# EAGLE schematic LR21_Dash (EAGLE 9.2.2)
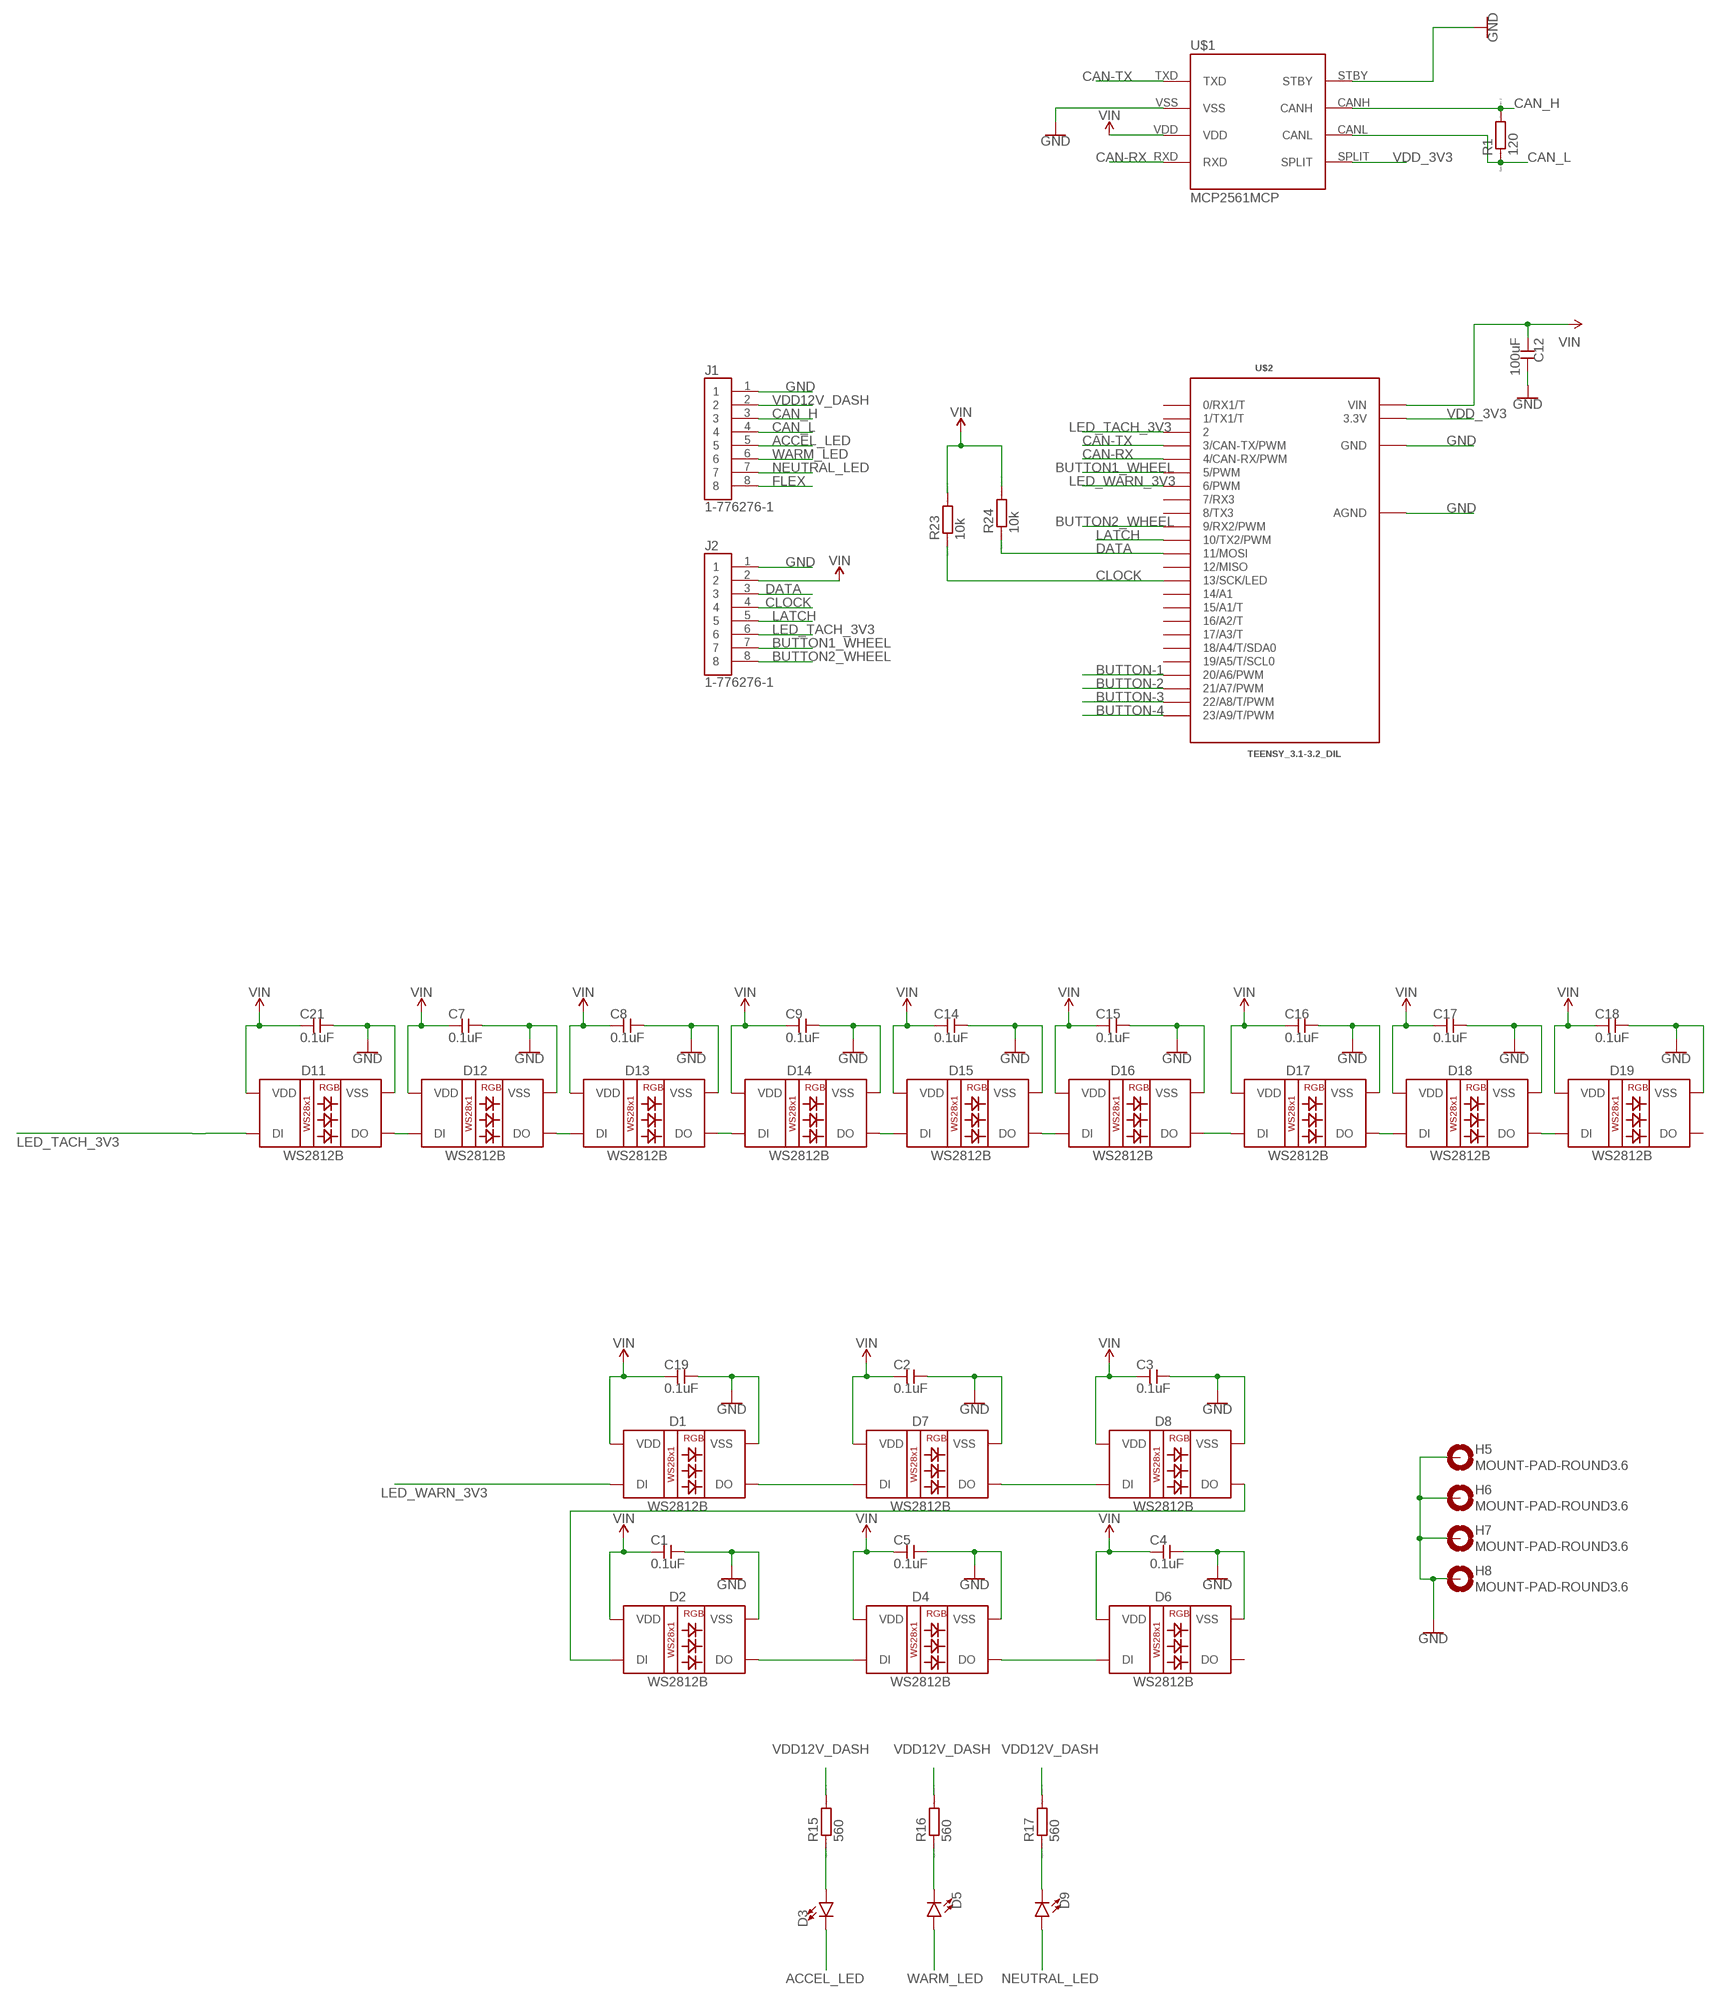
[diagram p0: schematic, sheet 1, part 1 of 2]
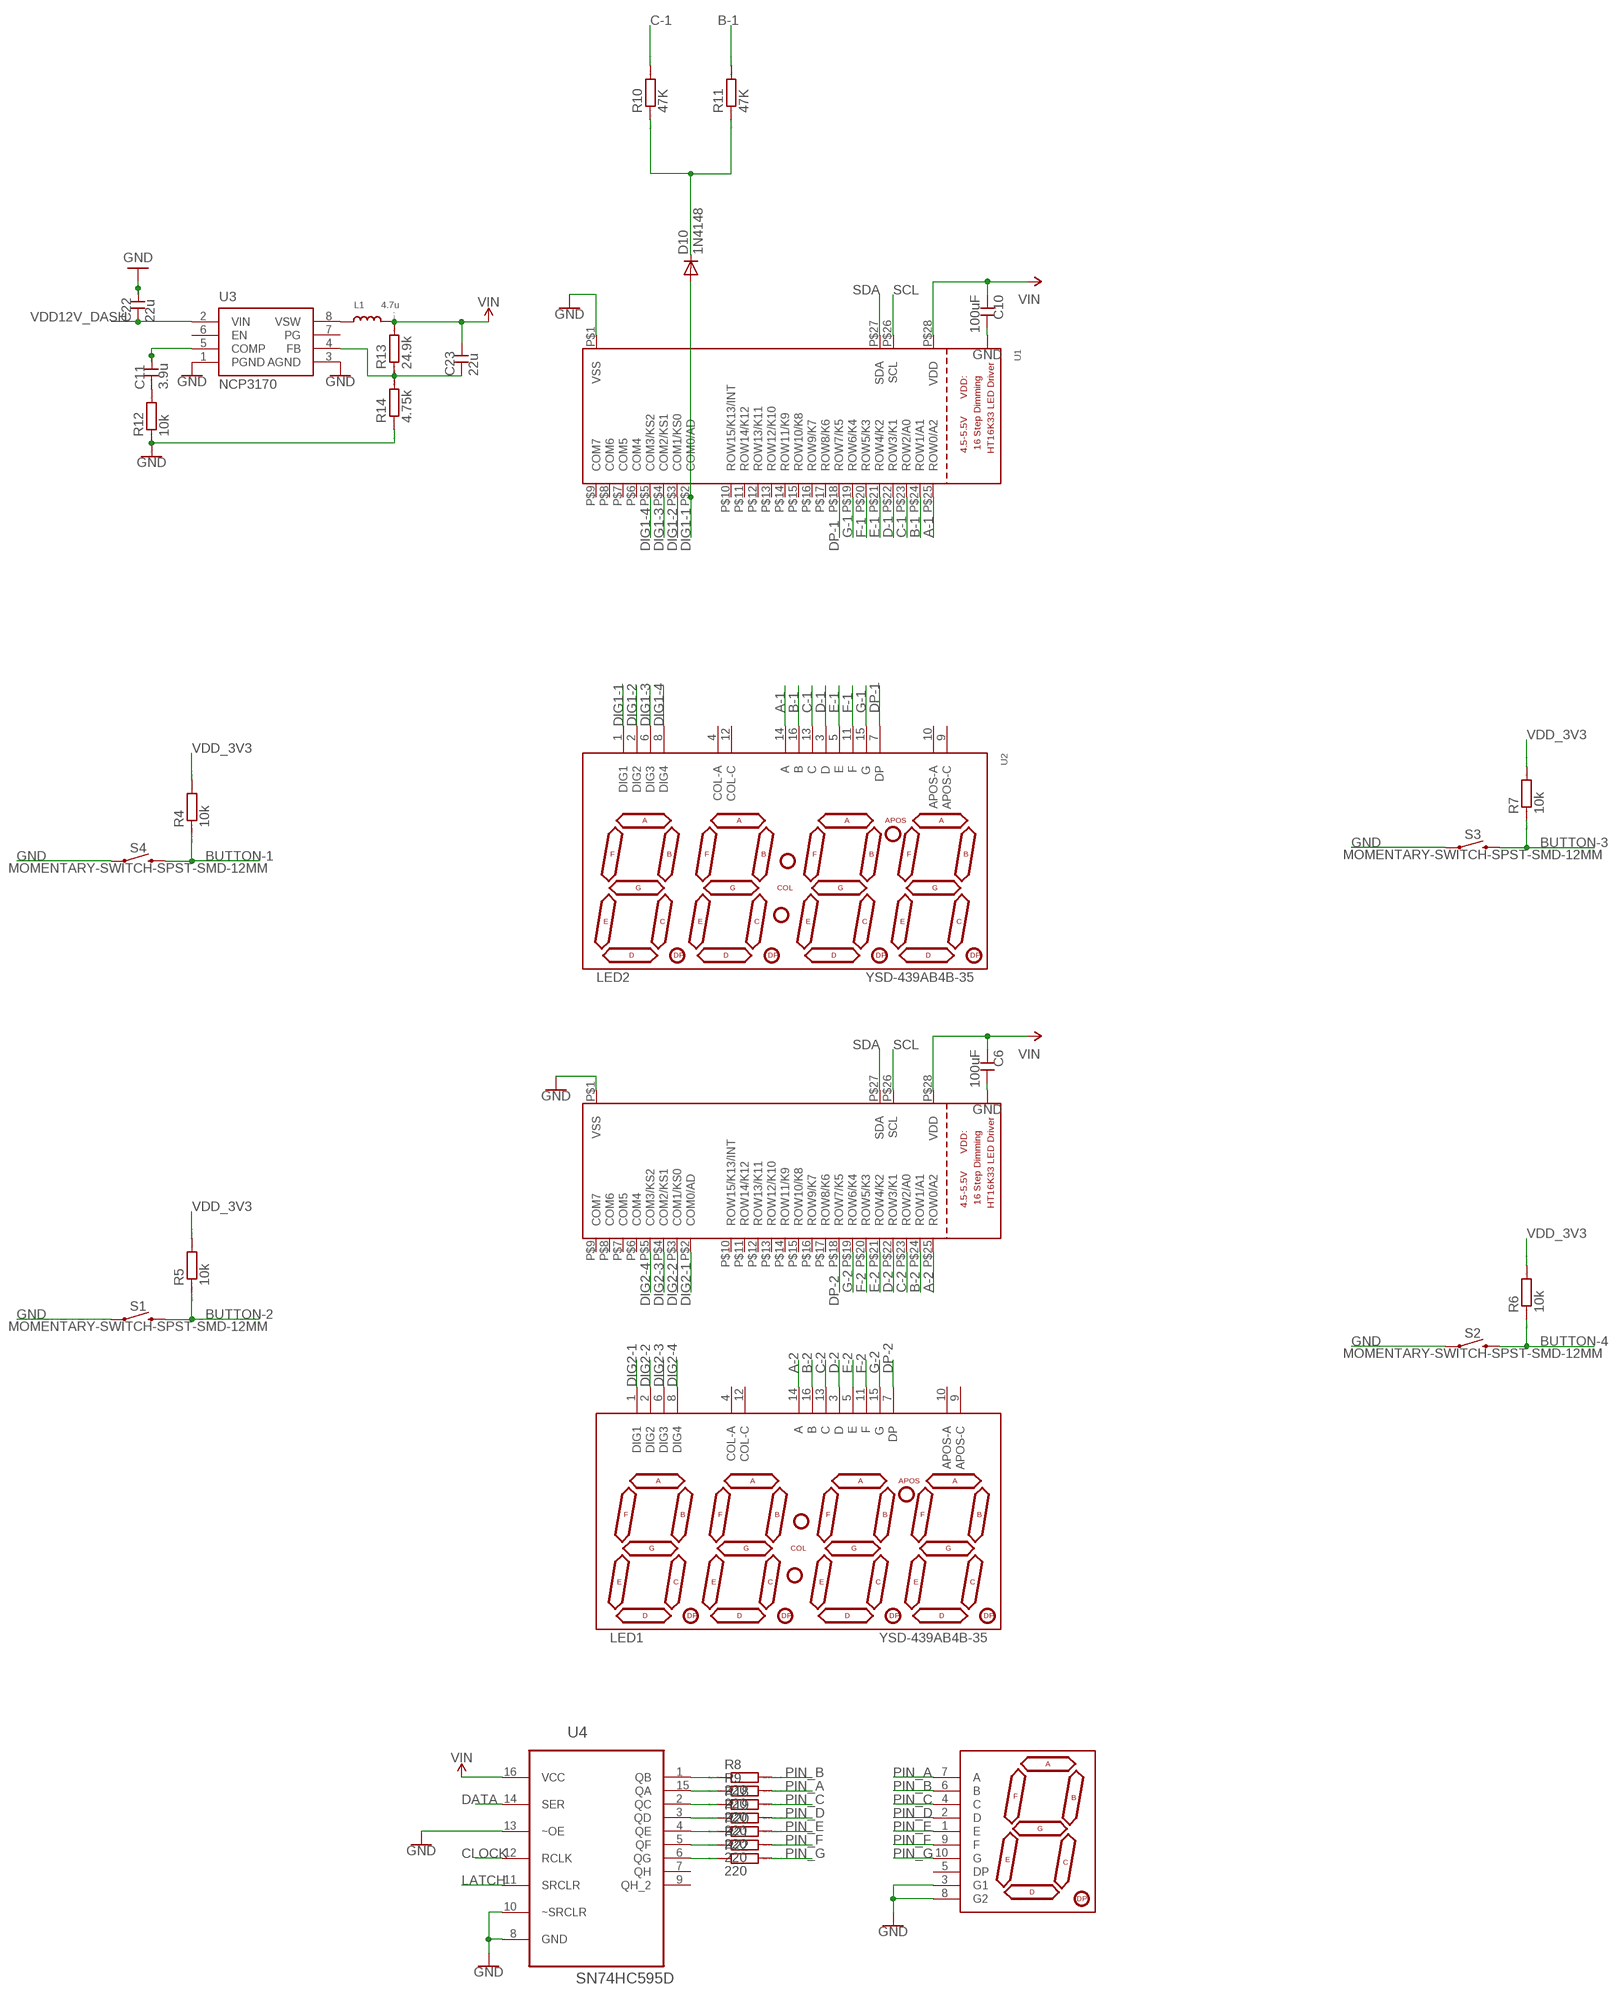
[diagram p1: schematic, sheet 1, part 2 of 2]

## Parts
C1  0.1uF  CAP-1005  [1005]
C2  0.1uF  CAP-1005  [1005]
C3  0.1uF  CAP-1005  [1005]
C4  0.1uF  CAP-1005  [1005]
C5  0.1uF  CAP-1005  [1005]
C6  100uF  CAP-1005  [1005]
C7  0.1uF  CAP-1005  [1005]
C8  0.1uF  CAP-1005  [1005]
C9  0.1uF  CAP-1005  [1005]
C10  100uF  CAP-1005  [1005]
C11  3.9u  CAP-1005  [1005]
C12  100uF  CAP-1005  [1005]
C14  0.1uF  CAP-1005  [1005]
C15  0.1uF  CAP-1005  [1005]
C16  0.1uF  CAP-1005  [1005]
C17  0.1uF  CAP-1005  [1005]
C18  0.1uF  CAP-1005  [1005]
C19  0.1uF  CAP-1005  [1005]
C21  0.1uF  CAP-1005  [1005]
C22  22u  CAP-1005  [1005]
C23  22u  CAP-1005  [1005]
D1  WS2812B  [WS2812B]
D2  WS2812B  [WS2812B]
D3  LED5MM  [LED_5MM]
D4  WS2812B  [WS2812B]
D5  LED5MM  [LED_5MM]
D6  WS2812B  [WS2812B]
D7  WS2812B  [WS2812B]
D8  WS2812B  [WS2812B]
D9  LED5MM  [LED_5MM]
D10  1N4148  [DO35-10]
D11  WS2812B  [WS2812B]
D12  WS2812B  [WS2812B]
D13  WS2812B  [WS2812B]
D14  WS2812B  [WS2812B]
D15  WS2812B  [WS2812B]
D16  WS2812B  [WS2812B]
D17  WS2812B  [WS2812B]
D18  WS2812B  [WS2812B]
D19  WS2812B  [WS2812B]
H5  MOUNT-PAD-ROUND3.6  [3,6-PAD]
H6  MOUNT-PAD-ROUND3.6  [3,6-PAD]
H7  MOUNT-PAD-ROUND3.6  [3,6-PAD]
H8  MOUNT-PAD-ROUND3.6  [3,6-PAD]
J1  1-776276-1  [TE_1-776276-1]
J2  1-776276-1  [TE_1-776276-1]
L1  4.7u  INDUCTOR  [INDUCTOR_1007]
LED1  YSD-439AB4B-35  7-SEGMENT-4DIGIT-10MM-BLUE  [7-SEGMENT-4DIGIT-YOUNGSUN]
LED2  YSD-439AB4B-35  7-SEGMENT-4DIGIT-10MM-BLUE  [7-SEGMENT-4DIGIT-YOUNGSUN]
R1  120  R  [R0805]
R4  10k  R  [R0805]
R5  10k  R  [R0805]
R6  10k  R  [R0805]
R7  10k  R  [R0805]
R8  220  R  [R0805]
R9  220  R  [R0805]
R10  47K  R  [R0805]
R11  47K  R  [R0805]
R12  10k  R  [R0805]
R13  24.9k  R  [R0805]
R14  4.75k  R  [R0805]
R15  560  R  [R0805]
R16  560  R  [R0805]
R17  560  R  [R0805]
R18  220  R  [R0805]
R19  220  R  [R0805]
R20  220  R  [R0805]
R21  220  R  [R0805]
R22  220  R  [R0805]
R23  10k  R  [R0805]
R24  10k  R  [R0805]
S1  MOMENTARY-SWITCH-SPST-SMD-12MM  [TACTILE_SWITCH_SMD_12MM]
S2  MOMENTARY-SWITCH-SPST-SMD-12MM  [TACTILE_SWITCH_SMD_12MM]
S3  MOMENTARY-SWITCH-SPST-SMD-12MM  [TACTILE_SWITCH_SMD_12MM]
S4  MOMENTARY-SWITCH-SPST-SMD-12MM  [TACTILE_SWITCH_SMD_12MM]
U1  HT16K33_SOP28  [SOP28_300MIL]
U2  HT16K33_SOP28  [SOP28_300MIL]
U3  NCP3170  [SOIC8]
U4  SN74HC595D  [SOIC127P600X175-16N]
U$1  MCP2561MCP  [MCP2561_PDIP]
U$2  TEENSY_3.1-3.2_DIL  [TEENSY_3.0-3.2&LC_DIL]
U$3  YSD-160AB3C-8  7-SEGMENT-1DIGIT-1INCH-BLUE  [7-SEGMENT-1"PTH]

## Nets
A-1: LED2.14(A) U1.P$25(ROW0/A2)
A-2: LED1.14(A) U2.P$25(ROW0/A2)
ACCEL_LED [pwr]: D3.K(C) J1.5
B-1: LED2.16(B) R11.2 U1.P$24(ROW1/A1)
B-2: LED1.16(B) U2.P$24(ROW1/A1)
BUTTON1_WHEEL: J2.7 U$2.5(5/PWM)
BUTTON2_WHEEL: J2.8 U$2.9(9/RX2/PWM)
BUTTON-1: R4.1 S4.3 U$2.20/A6(20/A6/PWM)
BUTTON-2: R5.1 S1.3 U$2.21/A7(21/A7/PWM)
BUTTON-3: R7.1 S3.3 U$2.22/A8(22/A8/T/PWM)
BUTTON-4: R6.1 S2.3 U$2.23/A9(23/A9/T/PWM)
C-1: LED2.13(C) R10.2 U1.P$23(ROW2/A0)
C-2: LED1.13(C) U2.P$23(ROW2/A0)
CAN-RX: U$1.RXD U$2.4(4/CAN-RX/PWM)
CAN-TX: U$1.TXD U$2.3(3/CAN-TX/PWM)
CAN_H: J1.3 R1.2 U$1.CANH
CAN_L: J1.4 R1.1 U$1.CANL
CLOCK: J2.4 R23.1 U4.12(RCLK) U$2.13(13/SCK/LED)
D-1: LED2.3(D) U1.P$22(ROW3/K1)
D-2: LED1.3(D) U2.P$22(ROW3/K1)
DATA: J2.3 R24.1 U4.14(SER) U$2.11(11/MOSI)
DIG1-1: D10.A LED2.1(DIG1) U1.P$2(COM0/AD)
DIG1-2: LED2.2(DIG2) U1.P$3(COM1/KS0)
DIG1-3: LED2.6(DIG3) U1.P$4(COM2/KS1)
DIG1-4: LED2.8(DIG4) U1.P$5(COM3/KS2)
DIG2-1: LED1.1(DIG1) U2.P$2(COM0/AD)
DIG2-2: LED1.2(DIG2) U2.P$3(COM1/KS0)
DIG2-3: LED1.6(DIG3) U2.P$4(COM2/KS1)
DIG2-4: LED1.8(DIG4) U2.P$5(COM3/KS2)
DP-1: LED2.7(DP) U1.P$18(ROW7/K5)
DP-2: LED1.7(DP) U2.P$18(ROW7/K5)
E-1: LED2.5(E) U1.P$21(ROW4/K2)
E-2: LED1.5(E) U2.P$21(ROW4/K2)
F-1: LED2.11(F) U1.P$20(ROW5/K3)
F-2: LED1.11(F) U2.P$20(ROW5/K3)
FLEX: J1.8
G-1: LED2.15(G) U1.P$19(ROW6/K4)
G-2: LED1.15(G) U2.P$19(ROW6/K4)
GND [pwr]: C1.P$2 C2.P$2 C3.P$2 C4.P$2 C5.P$2 C6.P$2 C7.P$2 C8.P$2 C9.P$2 C10.P$2 C12.P$2 C14.P$2 C15.P$2 C16.P$2 C17.P$2 C18.P$2 C19.P$2 C21.P$2 C22.P$2 D1.3(VSS) D2.3(VSS) D4.3(VSS) D6.3(VSS) D7.3(VSS) D8.3(VSS) D11.3(VSS) D12.3(VSS) D13.3(VSS) D14.3(VSS) D15.3(VSS) D16.3(VSS) D17.3(VSS) D18.3(VSS) D19.3(VSS) H5.B3,6(MOUNT) H6.B3,6(MOUNT) H7.B3,6(MOUNT) H8.B3,6(MOUNT) J1.1 J2.1 R12.1 R14.1 S1.1 S2.1 S3.1 S4.1 U1.P$1(VSS) U2.P$1(VSS) U3.1(PGND) U3.3(AGND) U4.8(GND) U4.10(~SRCLR) U4.13(~OE) U$1.STBY U$1.VSS U$2.AGND U$2.GND U$3.3(G1) U$3.8(G2)
LATCH: J2.5 U4.11(SRCLR) U$2.10(10/TX2/PWM)
LED_TACH_3V3: D11.4(DI) J2.6 U$2.2
LED_WARN_3V1: D13.2(DO) D14.4(DI)
LED_WARN_3V3: D1.4(DI) U$2.6(6/PWM)
N$2: D10.C R10.1 R11.1
N$4: D2.2(DO) D4.4(DI)
N$6: D4.2(DO) D6.4(DI)
N$8: D3.A R15.1
N$9: D5.K(C) R16.1
N$10 [pwr]: C11.P$2 U3.5(COMP)
N$11: D9.K(C) R17.1
N$12: C11.P$1 R12.2
N$14: D2.4(DI) D8.2(DO)
N$15: L1.P$1 U3.8(VSW)
N$16: R8.1 U4.1(QB)
N$17: R9.1 U4.15(QA)
N$18: R18.1 U4.2(QC)
N$19: R19.1 U4.3(QD)
N$20: R20.1 U4.4(QE)
N$21: D11.2(DO) D12.4(DI)
N$22 [pwr]: C23.P$1 R13.1 R14.2 U3.4(FB)
N$23: D1.2(DO) D7.4(DI)
N$24: D7.2(DO) D8.4(DI)
N$25: R21.1 U4.5(QF)
N$26: R22.1 U4.6(QG)
N$28: D12.2(DO) D13.4(DI)
N$29: D14.2(DO) D15.4(DI)
N$30: D15.2(DO) D16.4(DI)
N$31: D17.2(DO) D18.4(DI)
N$32: D18.2(DO) D19.4(DI)
N$33: D16.2(DO) D17.4(DI)
NEUTRAL_LED [pwr]: D9.A J1.7
PIN_A: R9.2 U$3.7(A)
PIN_B: R8.2 U$3.6(B)
PIN_C: R18.2 U$3.4(C)
PIN_D: R19.2 U$3.2(D)
PIN_E: R20.2 U$3.1(E)
PIN_F: R21.2 U$3.9(F)
PIN_G: R22.2 U$3.10(G)
SCL: U1.P$26(SCL) U2.P$26(SCL)
SDA: U1.P$27(SDA) U2.P$27(SDA)
VDD12V_DASH [pwr]: C22.P$1 J1.2 R15.2 R16.2 R17.2 U3.2(VIN)
VDD_3V3 [pwr]: R4.2 R5.2 R6.2 R7.2 U$1.SPLIT U$2.3.3V
VIN [pwr]: C1.P$1 C2.P$1 C3.P$1 C4.P$1 C5.P$1 C6.P$1 C7.P$1 C8.P$1 C9.P$1 C10.P$1 C12.P$1 C14.P$1 C15.P$1 C16.P$1 C17.P$1 C18.P$1 C19.P$1 C21.P$1 C23.P$2 D1.1(VDD) D2.1(VDD) D4.1(VDD) D6.1(VDD) D7.1(VDD) D8.1(VDD) D11.1(VDD) D12.1(VDD) D13.1(VDD) D14.1(VDD) D15.1(VDD) D16.1(VDD) D17.1(VDD) D18.1(VDD) D19.1(VDD) J2.2 L1.P$2 R13.2 R23.2 R24.2 U1.P$28(VDD) U2.P$28(VDD) U4.16(VCC) U$1.VDD U$2.VIN
WARM_LED [pwr]: D5.A J1.6
Unconnected: D6.2(DO) D19.2(DO) LED1.4(COL-A) LED1.9(APOS-C) LED1.10(APOS-A) LED1.12(COL-C) LED2.4(COL-A) LED2.9(APOS-C) LED2.10(APOS-A) LED2.12(COL-C) U1.P$6(COM4) U1.P$7(COM5) U1.P$8(COM6) U1.P$9(COM7) U1.P$10(ROW15/K13/INT) U1.P$11(ROW14/K12) U1.P$12(ROW13/K11) U1.P$13(ROW12/K10) U1.P$14(ROW11/K9) U1.P$15(ROW10/K8) U1.P$16(ROW9/K7) U1.P$17(ROW8/K6) U2.P$6(COM4) U2.P$7(COM5) U2.P$8(COM6) U2.P$9(COM7) U2.P$10(ROW15/K13/INT) U2.P$11(ROW14/K12) U2.P$12(ROW13/K11) U2.P$13(ROW12/K10) U2.P$14(ROW11/K9) U2.P$15(ROW10/K8) U2.P$16(ROW9/K7) U2.P$17(ROW8/K6) U3.6(EN) U3.7(PG) U4.7(QH) U4.9(QH_2) U$2.0(0/RX1/T) U$2.1(1/TX1/T) U$2.7(7/RX3) U$2.8(8/TX3) U$2.12(12/MISO) U$2.14/A0(14/A1) U$2.15/A1(15/A1/T) U$2.16/A2(16/A2/T) U$2.17/A3(17/A3/T) U$2.18/A4(18/A4/T/SDA0) U$2.19/A5(19/A5/T/SCL0) U$3.5(DP)

## Library data of the parts
C1-C12 C14-C19 C21-C23 = scenix4:CAP-1005
D1 D2 D4 D6-D8 D11-D19 = SparkFun-LED@1:WS2812B: WS2812B SMD addressable RGB LED 5x5mm SMD LED with built-in controller IC. Color: Red/Green/Blue mC Rating: RGB: 390, 660, 180 mcd Forward Voltage: RGB: 2.0, 3.0, 3.0 V Packages:WS2812B SparkFun Products: Blynk Board - ESP8266 <https://www.sparkfun.com/products/13794>; PROD_ID: DIO-12503
D3 D5 D9 = SparkFun-LED:LED: LED (Generic) Standard schematic elements and footprints for 5mm, 3mm, 1206, and 0603 sized LEDs. Generic LEDs with no color specified.
D10 = diode:1N4148: DIODE high speed (Philips)
H5-H8 = holes:MOUNT-PAD-ROUND: MOUNTING PAD, round
J1 J2 = 1-776276-1:1-776276-1: CONN HEADER 8POS VERT GOLD BLK; MANUFACTURER: TE Connectivity; METADATA: Manufacturer recommendations; PARTREV: B9
L1 = microbuilder:INDUCTOR: Inductors 0603: 10nH Ceramic Inductor - microwire antenna/RF (Digikey: 712-1434-2-ND) 0805: 560nH Ceramic Inductor - RF (Digikey: 553-1047-1-ND) 270nH Ceramic Inductor - Q = 40@250MHz, +-5%, 1 Ohm DC Resistance (Digikey: 535-10506-2-ND) 1007 (2518 Metric) SMT: 10µH 10% 250mOhm 820mA 1007 Inductor (Digikey: 587-2189-1-ND) 22µH 10% 500mOhm 580mA 1007 Inductor (Digikey: 587-2190-1-ND) 47µH 10% 950mOhm 420mA 1007 Inductor (Digikey: 587-2191-1-ND) 47µH 5% 100mOhm 1A 1008 Inductor (Digikey: 732-1816-1-ND) 5.0x5.0mm (Taiyo Yuden NR5040 Series) 6.8µH 20% 2.3A 64mOhm Inductor (Digikey: 587-2374-2-ND) 5.0x5.0mm (TDK VLC5045 Series) 4.7µH 20% 3.3A 34mOhm Inductor (Digikey: 445-6526-1-ND) 6.8µH 20% 2.7A 46mOhm Inductor (Digikey: 445-6527-1-ND) 6.0x6.0mm (TDK VLC6045 Series) 4.7µH 20% 3.8A 27mOhm Inductor (Digikey: 445-6538-2-ND) 6.8µH 20% 3A 41mOhm Inductor (Digikey: 445-6540-1-ND) 6.2µH 30% 2.2A 45mOhm Inductor (Digikey: SRR5028-6R2YCT-ND) - Not TDK VLC6045 but footprint should match 6.0x6.0mm (TDK SLF6045 Series) 6.8uH 30% 2A 33mOhm Inductor (Digikey: 445-4572-1-ND, Mouser: 810-SLF645T6R8N2R0PF)
LED1 LED2 = SparkFun-LED@1:7-SEGMENT-4DIGIT-10MM: 4 Digit 7 Segment Display This is a part for the 4-Digit 7-segment LEDs from Young Sun. Different from the Digikey LEDs, all 16 pins are used. The LONGPADS Variant is used for a test jig, but you may like it because there is more pad to solder to. If you are concerned about routing space, the standard works just fine though. Datasheets: Red <http://www.sparkfun.com/datasheets/Components/LED/7-Segment/YSD-439AR6B-35.pdf> Yellow <http://www.sparkfun.com/datasheets/Components/LED/7-Segment/YSD-439AY2B-35.pdf> Kelly Green <http://www.sparkfun.com/datasheets/Components/LED/7-Segment/YSD-439AK2B-35.pdf> Blue <http://www.sparkfun.com/datasheets/Components/LED/7-Segment/YSD-439AB4B-35.pdf> White <http://cdn.sparkfun.com/datasheets/Components/LED/ATA3492BW_2.pdf> SparkFun Products Raw Components 7-Segment Display - 4-Digit (Red) <https://www.sparkfun.com/products/9483> (COM-09483) 7-Segment Display - 4-Digit (Yellow) <https://www.sparkfun.com/products/9480> (COM-09480) 7-Segment Display - 4-Digit (Kelly Green) <https://www.sparkfun.com/products/9482> (COM-09482) 7-Segment Display - 4-Digit (Blue) <https://www.sparkfun.com/products/9481> (COM-09481) 7-Segment Display - 4-Digit (White) <https://www.sparkfun.com/products/10931> ( COM-10931) Serial Controlled SparkFun 7-Segment Serial Display - Red <https://www.sparkfun.com/products/11441> (COM-11441) SparkFun 7-Segment Serial Display - Yellow <https://www.sparkfun.com/products/11443> (COM-11443) SparkFun 7-Segment Serial Display - Kelly Green <https://www.sparkfun.com/products/11440> (COM-11440) SparkFun 7-Segment Serial Display - Blue <https://www.sparkfun.com/products/11442> (COM-11442) SparkFun 7-Segment Serial Display - White <https://www.sparkfun.com/products/11629> (COM-11629) Other SparkFun BigTime Watch Kit <https://www.sparkfun.com/products/11734> (KIT-11734); PROD_ID: COMP-09664
R1 R4-R24 = eagle-ltspice:R: RESISTOR, European symbol; SPICEMODEL: NONE; SPICEPREFIX: R
S1-S4 = SparkFun-Switches:MOMENTARY-SWITCH-SPST: Momentary Switch (Pushbutton) - SPST Normally-open (NO) SPST momentary switches (buttons, pushbuttons). Variants PTH-12MM - 12mm square, through-hole Momentary Pushbutton Switch - 12mm Square <https://www.sparkfun.com/products/9190> (COM-09190) PTH-6.0MM, PTH-6.0MM-KIT - 6.0mm square, through-hole Mini Pushbutton Switch <https://www.sparkfun.com/products/97> (COM-00097) KIT package intended for soldering kit's - only one side of pads' copper is exposed. PTH-RIGHT-ANGLE-KIT - Right-angle, through-hole Right Angle Tactile Button <https://www.sparkfun.com/products/10791> - Used on SparkFun BigTime Watch Kit <https://www.sparkfun.com/products/11734> SMD-12MM - 12mm square, surface-mount Tactile Button - SMD (12mm) <https://www.sparkfun.com/products/12993> (COM-12993) Used on SparkFun PicoBoard <https://www.sparkfun.com/products/11888> SMD-4.5MM - 4.5mm Square Trackball Switch Used on SparkFun Blackberry Trackballer Breakout <https://www.sparkfun.com/products/13169> SMD-4.6MMX2.8MM - 4.60mm x 2.80mm, surface mount Used on SparkFun SAMD21 Mini Breakout <https://www.sparkfun.com/products/13664> SMD-5.2MM, SMD-5.2-REDUNDANT - 5.2mm square, surface-mount Mini Pushbutton Switch - SMD <https://www.sparkfun.com/products/8720> (COM-08720) Used on Arduino Pro Mini <https://www.sparkfun.com/products/11114> REDUNDANT package connects both switch circuits together SMD-6.0X3.5MM - 6.0 x 3.5mm, surface mount Momentary Reset Switch SMD <https://www.sparkfun.com/products/8229> (COM-08229) SMD-6.2MM-TALL - 6.2mm square, surface mount Tactile Button - SMD (6mm) <https://www.sparkfun.com/products/12992> Used on SparkFun Digital Sandbox <https://www.sparkfun.com/products/12651> SMD-RIGHT-ANGLE - Right-angle, surface mount Used on SparkFun Block for Intel® Edison - Arduino <https://www.sparkfun.com/products/13036>; PROD_ID: SWCH-11967; SF_SKU: COM-12993
U1 U2 = microbuilder:HT16K33_SOP28
U3 = NCP3170:NCP3170; AVAILABILITY: Unavailable; DESCRIPTION: ON Semiconductor 3A SWITCHING REGULATOR; MF: ON Semiconductor; MP: NCP3170; PACKAGE: SOIC-8 ON Semiconductor; PRICE: None
U4 = SN74HC595D:SN74HC595D: 8-BIT SHIFT REGISTERS WITH 3-STATE OUTPUT REGISTERS; DESCRIPTION: Shift Register Single 8-Bit Serial to Serial/Parallel 16-Pin SOIC Tube; DIGI-KEY_PART_NUMBER: 296-8344-5-ND; DIGI-KEY_PURCHASE_URL: https://www.digikey.com/product-detail/en/texas-instruments/SN74HC595D/296-8344-5-ND/376752?utm_source=snapeda&utm_medium=aggregator&utm_campaign=symbol; MF: Texas Instruments; MP: SN74HC595D; PACKAGE: SOIC-16 Texas Instruments
U$1 = PoJD:MCP2561: High-Speed CAN Transceiver See http://ww1.microchip.com/downloads/en/DeviceDoc/25167A.pdf The MCP2561/2 is a Microchip Technology Inc. second generation high-speed CAN transceiver. It serves as an interface between a CAN protocol controller and the physical two-wire CAN bus. The device meets the automotive requirements for high-speed (up to 1 Mb/s), low quiescent current, electromagnetic compatibility (EMC) and electrostatic discharge (ESD).
U$2 = Teensy_3_and_LC_Series_Boards_v1.4:TEENSY_3.1-3.2_DIL: Teensy 3.1 or 3.2 in a DIL Layout.
U$3 = SparkFun-LED:7-SEGMENT-1DIGIT-1INCH: 7-Segment Display, single digit, 1" EZ is for kits. Pads are only exposed on the bottom side to help prevent soldering in upside down. Datasheet (Red) <https://cdn.sparkfun.com/datasheets/Components/LED/YSD-160AR4B-8.pdf> Datasheet (Blue) <https://cdn.sparkfun.com/datasheets/Components/LED/YSD-160AB3C-8.pdf> SparkFun Products 7-Segment Display - LED (Red) <https://www.sparkfun.com/products/8546> (COM-08546) 7-Segment Display - LED (Blue) <https://www.sparkfun.com/products/9191> (COM-09191); PROD_ID: COMP-09495

## Net classes
0 default: width 0.254 mm, drill 0.55 mm
1 pwr: width 0.508 mm, drill 0.55 mm